# EAGLE schematic Control.Board (EAGLE 6.6.0)

## Sheet 1 of 5: Интеграция с датчиками
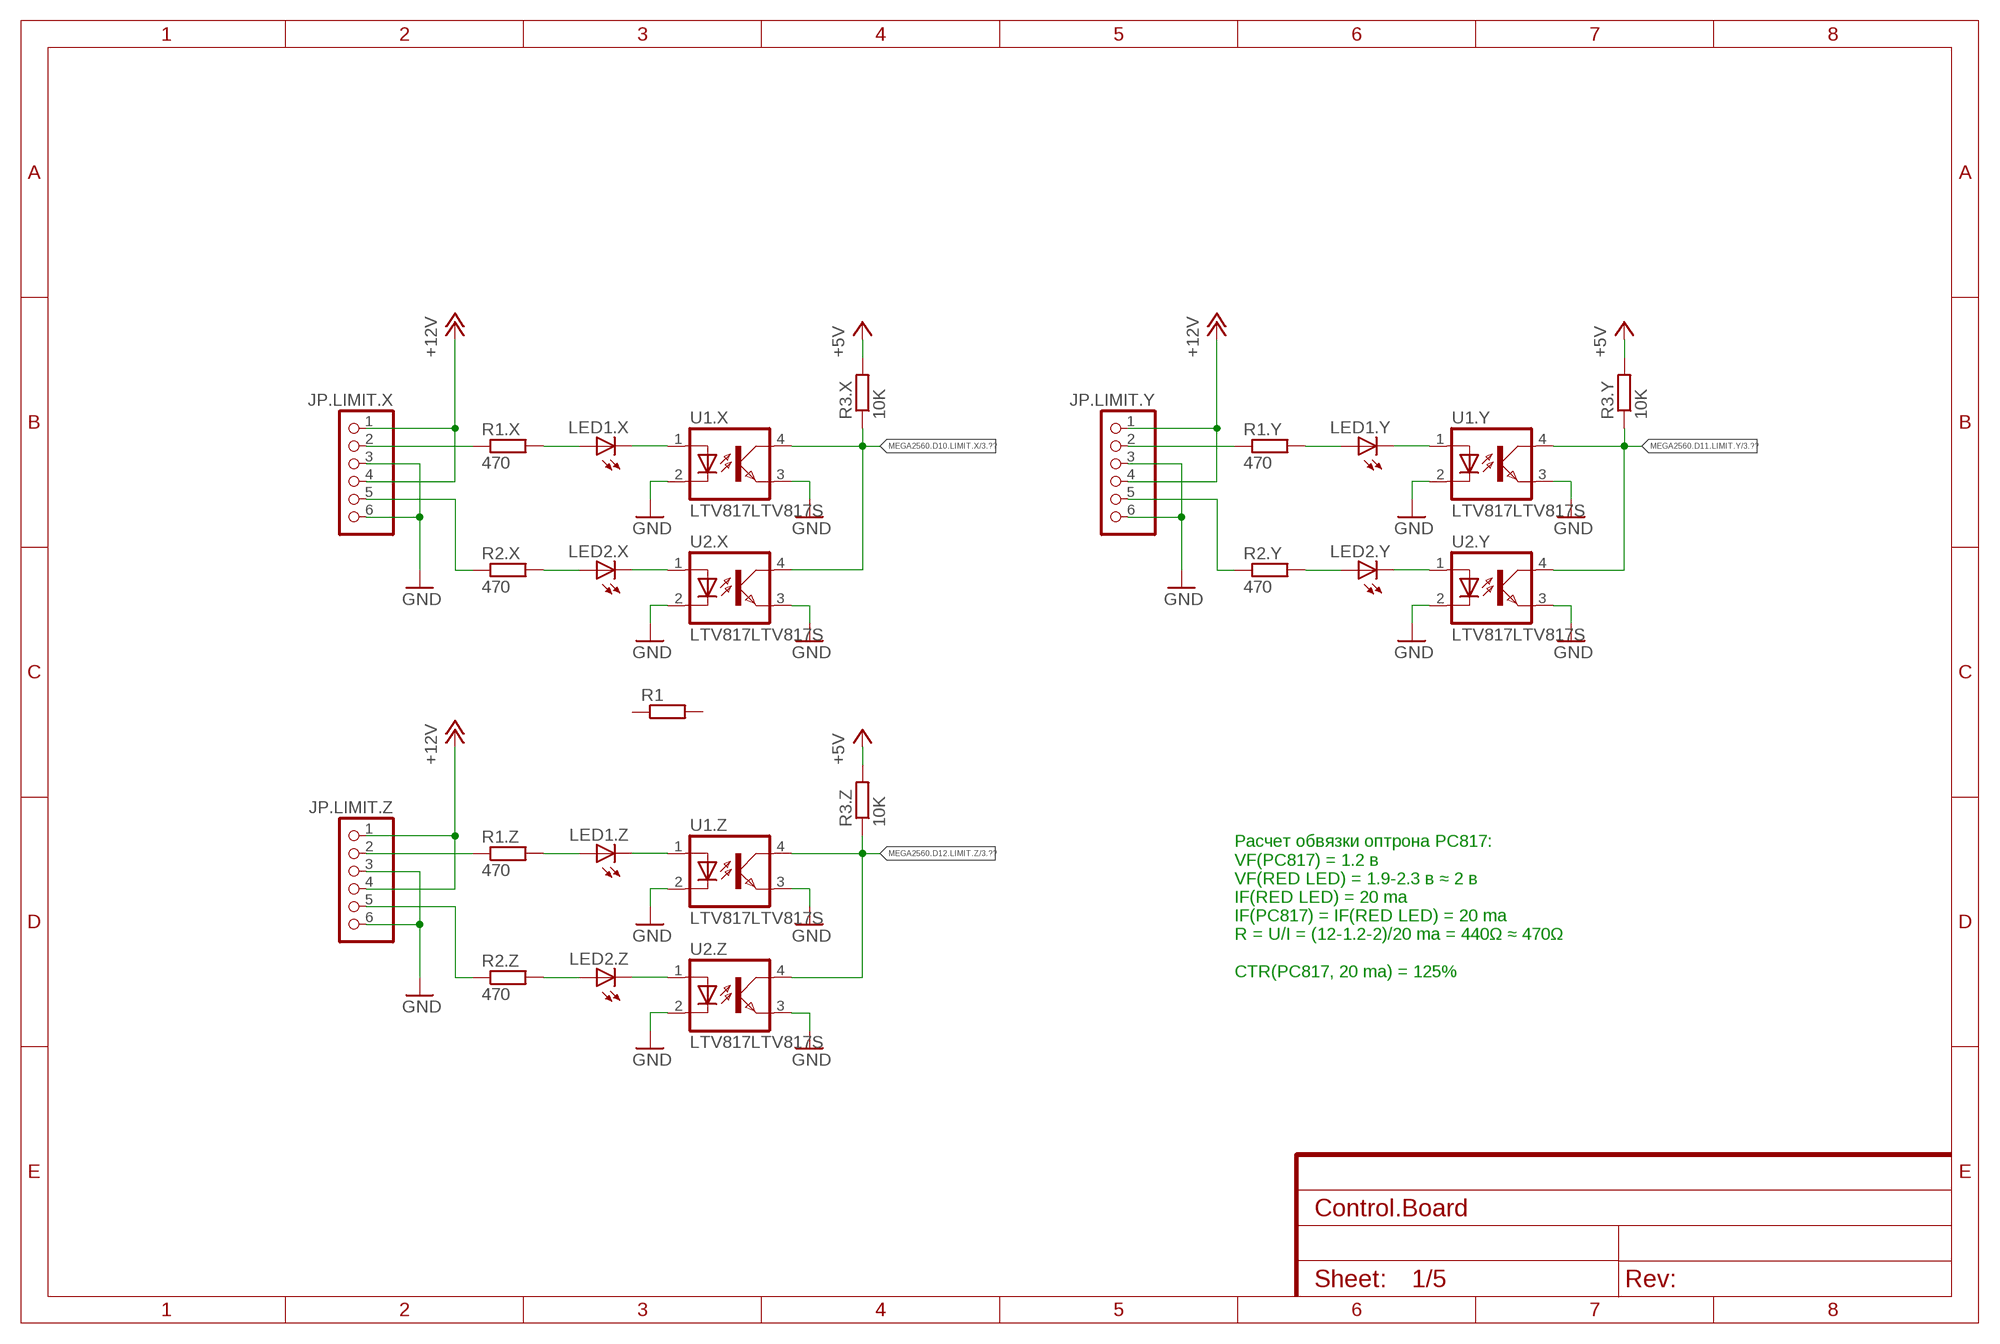
[diagram p0: schematic, sheet 1]

### Parts
JP.LIMIT.X  PINHD-1X6  [1X06]
JP.LIMIT.Y  PINHD-1X6  [1X06]
JP.LIMIT.Z  PINHD-1X6  [1X06]
LED1.X  LEDCHIPLED_0805  [CHIPLED_0805]
LED1.Y  LEDCHIPLED_0805  [CHIPLED_0805]
LED1.Z  LEDCHIPLED_0805  [CHIPLED_0805]
LED2.X  LEDCHIPLED_0805  [CHIPLED_0805]
LED2.Y  LEDCHIPLED_0805  [CHIPLED_0805]
LED2.Z  LEDCHIPLED_0805  [CHIPLED_0805]
R1  R-EU_M1206  [M1206]
R1.X  470  R-EU_M0805  [M0805]
R1.Y  470  R-EU_M0805  [M0805]
R1.Z  470  R-EU_M0805  [M0805]
R2.X  470  R-EU_M0805  [M0805]
R2.Y  470  R-EU_M0805  [M0805]
R2.Z  470  R-EU_M0805  [M0805]
R3.X  10K  R-EU_M0805  [M0805]
R3.Y  10K  R-EU_M0805  [M0805]
R3.Z  10K  R-EU_M0805  [M0805]
U1.X  LTV817LTV817S  [DIL4-SMD]
U1.Y  LTV817LTV817S  [DIL4-SMD]
U1.Z  LTV817LTV817S  [DIL4-SMD]
U2.X  LTV817LTV817S  [DIL4-SMD]
U2.Y  LTV817LTV817S  [DIL4-SMD]
U2.Z  LTV817LTV817S  [DIL4-SMD]

### Nets
+5V: R3.X.2 R3.Y.2 R3.Z.2 ; also sheet 4,5
+12V: JP.LIMIT.X.1 JP.LIMIT.X.4 JP.LIMIT.Y.1 JP.LIMIT.Y.4 JP.LIMIT.Z.1 JP.LIMIT.Z.4
GND: JP.LIMIT.X.3 JP.LIMIT.X.6 JP.LIMIT.Y.3 JP.LIMIT.Y.6 JP.LIMIT.Z.3 JP.LIMIT.Z.6 U1.X.2(C) U1.X.3(EMIT) U1.Y.2(C) U1.Y.3(EMIT) U1.Z.2(C) U1.Z.3(EMIT) U2.X.2(C) U2.X.3(EMIT) U2.Y.2(C) U2.Y.3(EMIT) U2.Z.2(C) U2.Z.3(EMIT) ; also sheet 5
MEGA2560.D10.LIMIT.X: R3.X.1 U1.X.4(COL) U2.X.4(COL) ; also sheet 3
MEGA2560.D11.LIMIT.Y: R3.Y.1 U1.Y.4(COL) U2.Y.4(COL) ; also sheet 3
MEGA2560.D12.LIMIT.Z: R3.Z.1 U1.Z.4(COL) U2.Z.4(COL) ; also sheet 3
N$1: LED2.X.C U2.X.1(A)
N$2: JP.LIMIT.Y.2 R1.Y.1
N$3: LED1.Y.A R1.Y.2
N$4: JP.LIMIT.X.2 R1.X.1
N$5: LED1.X.A R1.X.2
N$6: JP.LIMIT.X.5 R2.X.1
N$7: LED2.X.A R2.X.2
N$8: LED1.X.C U1.X.1(A)
N$9: JP.LIMIT.Y.5 R2.Y.1
N$10: LED2.Y.A R2.Y.2
N$11: LED2.Y.C U2.Y.1(A)
N$12: LED1.Y.C U1.Y.1(A)
N$13: JP.LIMIT.Z.2 R1.Z.1
N$14: LED1.Z.A R1.Z.2
N$15: JP.LIMIT.Z.5 R2.Z.1
N$16: LED2.Z.A R2.Z.2
N$17: LED2.Z.C U2.Z.1(A)
N$18: LED1.Z.C U1.Z.1(A)
Unconnected: R1.1 R1.2

### Notes on the sheet
- Расчет обвязки оптрона PC817:
  VF(PC817) = 1.2 в
  VF(RED LED) = 1.9-2.3 в ≈ 2 в
  IF(RED LED) = 20 ma
  IF(PC817) = IF(RED LED) = 20 ma
  R = U/I = (12-1.2-2)/20 ma = 440Ω ≈ 470Ω
  
  CTR(PC817, 20 ma) = 125%

## Sheet 2 of 5: Измерение частоты

## Sheet 3 of 5: Arduino Mega2560 Shield
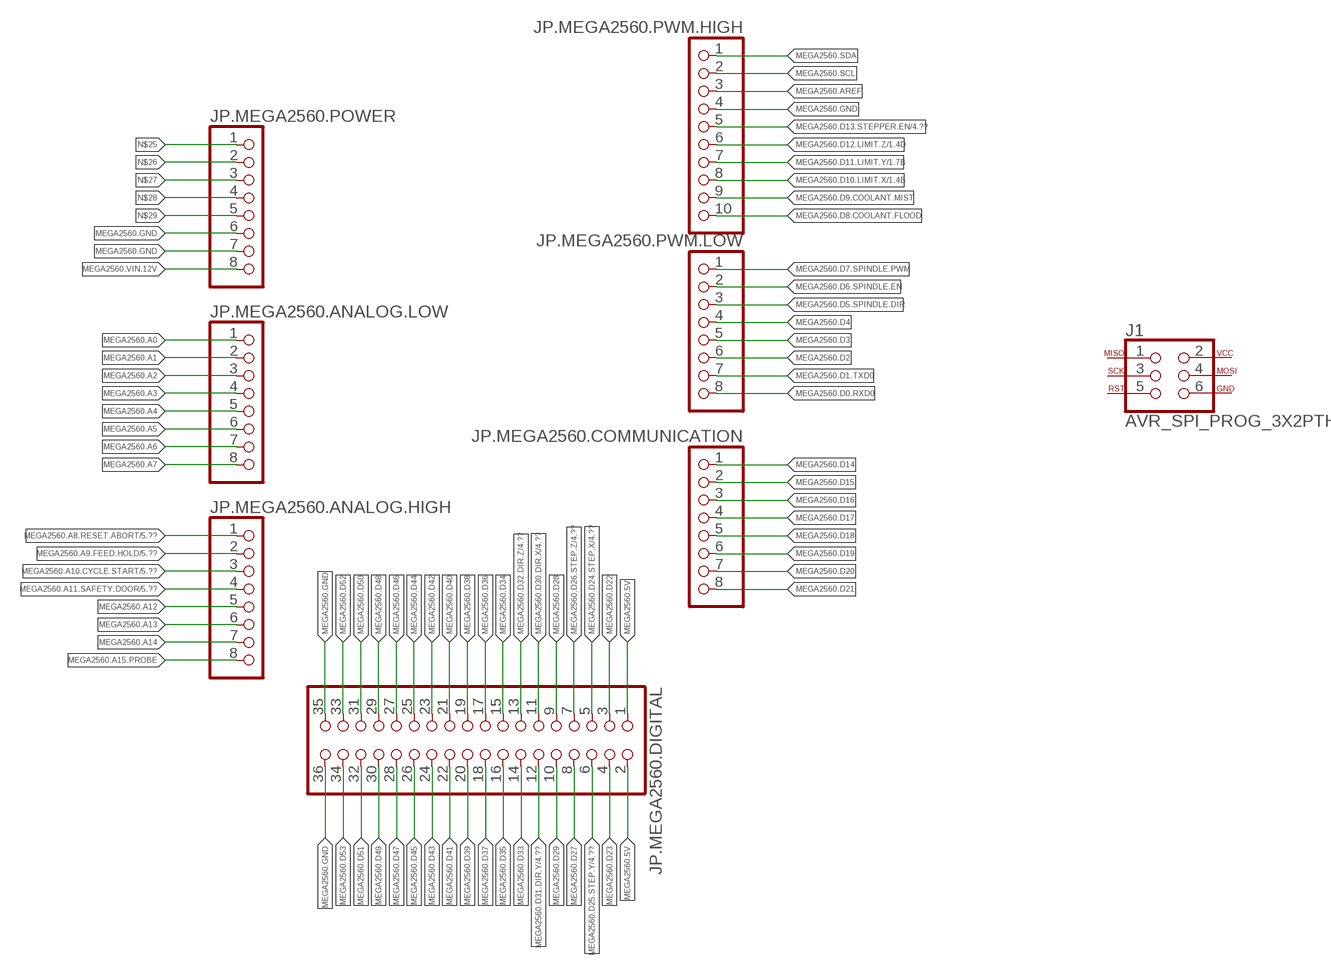
[diagram p1: schematic, sheet 3]

### Parts
J1  AVR_SPI_PROG_3X2PTH  [2X3]
JP.MEGA2560.ANALOG.HIGH  PINHD-1X8  [1X08]
JP.MEGA2560.ANALOG.LOW  PINHD-1X8  [1X08]
JP.MEGA2560.COMMUNICATION  PINHD-1X8  [1X08]
JP.MEGA2560.DIGITAL  PINHD-2X18  [2X18]
JP.MEGA2560.POWER  PINHD-1X8  [1X08]
JP.MEGA2560.PWM.HIGH  PINHD-1X10  [1X10]
JP.MEGA2560.PWM.LOW  PINHD-1X8  [1X08]

### Nets
MEGA2560.5V: JP.MEGA2560.DIGITAL.1 JP.MEGA2560.DIGITAL.2
MEGA2560.A0: JP.MEGA2560.ANALOG.LOW.1
MEGA2560.A1: JP.MEGA2560.ANALOG.LOW.2
MEGA2560.A2: JP.MEGA2560.ANALOG.LOW.3
MEGA2560.A3: JP.MEGA2560.ANALOG.LOW.4
MEGA2560.A4: JP.MEGA2560.ANALOG.LOW.5
MEGA2560.A5: JP.MEGA2560.ANALOG.LOW.6
MEGA2560.A6: JP.MEGA2560.ANALOG.LOW.7
MEGA2560.A7: JP.MEGA2560.ANALOG.LOW.8
MEGA2560.A8.RESET.ABORT: JP.MEGA2560.ANALOG.HIGH.1 ; also sheet 5
MEGA2560.A9.FEED.HOLD: JP.MEGA2560.ANALOG.HIGH.2 ; also sheet 5
MEGA2560.A10.CYCLE.START: JP.MEGA2560.ANALOG.HIGH.3 ; also sheet 5
MEGA2560.A11.SAFETY.DOOR: JP.MEGA2560.ANALOG.HIGH.4 ; also sheet 5
MEGA2560.A12: JP.MEGA2560.ANALOG.HIGH.5
MEGA2560.A13: JP.MEGA2560.ANALOG.HIGH.6
MEGA2560.A14: JP.MEGA2560.ANALOG.HIGH.7
MEGA2560.A15.PROBE: JP.MEGA2560.ANALOG.HIGH.8
MEGA2560.AREF: JP.MEGA2560.PWM.HIGH.3
MEGA2560.D0.RXD0: JP.MEGA2560.PWM.LOW.8
MEGA2560.D1.TXD0: JP.MEGA2560.PWM.LOW.7
MEGA2560.D2: JP.MEGA2560.PWM.LOW.6
MEGA2560.D3: JP.MEGA2560.PWM.LOW.5
MEGA2560.D4: JP.MEGA2560.PWM.LOW.4
MEGA2560.D5.SPINDLE.DIR: JP.MEGA2560.PWM.LOW.3
MEGA2560.D6.SPINDLE.EN: JP.MEGA2560.PWM.LOW.2
MEGA2560.D7.SPINDLE.PWM: JP.MEGA2560.PWM.LOW.1
MEGA2560.D8.COOLANT.FLOOD: JP.MEGA2560.PWM.HIGH.10
MEGA2560.D9.COOLANT.MIST: JP.MEGA2560.PWM.HIGH.9
MEGA2560.D10.LIMIT.X: JP.MEGA2560.PWM.HIGH.8 ; also sheet 1
MEGA2560.D11.LIMIT.Y: JP.MEGA2560.PWM.HIGH.7 ; also sheet 1
MEGA2560.D12.LIMIT.Z: JP.MEGA2560.PWM.HIGH.6 ; also sheet 1
MEGA2560.D13.STEPPER.EN: JP.MEGA2560.PWM.HIGH.5 ; also sheet 4
MEGA2560.D14: JP.MEGA2560.COMMUNICATION.1
MEGA2560.D15: JP.MEGA2560.COMMUNICATION.2
MEGA2560.D16: JP.MEGA2560.COMMUNICATION.3
MEGA2560.D17: JP.MEGA2560.COMMUNICATION.4
MEGA2560.D18: JP.MEGA2560.COMMUNICATION.5
MEGA2560.D19: JP.MEGA2560.COMMUNICATION.6
MEGA2560.D20: JP.MEGA2560.COMMUNICATION.7
MEGA2560.D21: JP.MEGA2560.COMMUNICATION.8
MEGA2560.D22: JP.MEGA2560.DIGITAL.3
MEGA2560.D23: JP.MEGA2560.DIGITAL.4
MEGA2560.D24.STEP.X: JP.MEGA2560.DIGITAL.5 ; also sheet 4
MEGA2560.D25.STEP.Y: JP.MEGA2560.DIGITAL.6 ; also sheet 4
MEGA2560.D26.STEP.Z: JP.MEGA2560.DIGITAL.7 ; also sheet 4
MEGA2560.D27: JP.MEGA2560.DIGITAL.8
MEGA2560.D28: JP.MEGA2560.DIGITAL.9
MEGA2560.D29: JP.MEGA2560.DIGITAL.10
MEGA2560.D30.DIR.X: JP.MEGA2560.DIGITAL.11 ; also sheet 4
MEGA2560.D31.DIR.Y: JP.MEGA2560.DIGITAL.12 ; also sheet 4
MEGA2560.D32.DIR.Z: JP.MEGA2560.DIGITAL.13 ; also sheet 4
MEGA2560.D33: JP.MEGA2560.DIGITAL.14
MEGA2560.D34: JP.MEGA2560.DIGITAL.15
MEGA2560.D35: JP.MEGA2560.DIGITAL.16
MEGA2560.D36: JP.MEGA2560.DIGITAL.17
MEGA2560.D37: JP.MEGA2560.DIGITAL.18
MEGA2560.D38: JP.MEGA2560.DIGITAL.19
MEGA2560.D39: JP.MEGA2560.DIGITAL.20
MEGA2560.D40: JP.MEGA2560.DIGITAL.21
MEGA2560.D41: JP.MEGA2560.DIGITAL.22
MEGA2560.D42: JP.MEGA2560.DIGITAL.23
MEGA2560.D43: JP.MEGA2560.DIGITAL.24
MEGA2560.D44: JP.MEGA2560.DIGITAL.25
MEGA2560.D45: JP.MEGA2560.DIGITAL.26
MEGA2560.D46: JP.MEGA2560.DIGITAL.27
MEGA2560.D47: JP.MEGA2560.DIGITAL.28
MEGA2560.D48: JP.MEGA2560.DIGITAL.29
MEGA2560.D49: JP.MEGA2560.DIGITAL.30
MEGA2560.D50: JP.MEGA2560.DIGITAL.31
MEGA2560.D51: JP.MEGA2560.DIGITAL.32
MEGA2560.D52: JP.MEGA2560.DIGITAL.33
MEGA2560.D53: JP.MEGA2560.DIGITAL.34
MEGA2560.GND: JP.MEGA2560.DIGITAL.35 JP.MEGA2560.DIGITAL.36 JP.MEGA2560.POWER.6 JP.MEGA2560.POWER.7 JP.MEGA2560.PWM.HIGH.4
MEGA2560.SCL: JP.MEGA2560.PWM.HIGH.2
MEGA2560.SDA: JP.MEGA2560.PWM.HIGH.1
MEGA2560.VIN.12V: JP.MEGA2560.POWER.8
N$25: JP.MEGA2560.POWER.1
N$26: JP.MEGA2560.POWER.2
N$27: JP.MEGA2560.POWER.3
N$28: JP.MEGA2560.POWER.4
N$29: JP.MEGA2560.POWER.5
Unconnected: J1.1 J1.2 J1.3 J1.4 J1.5 J1.6

## Sheet 4 of 5: Connectors
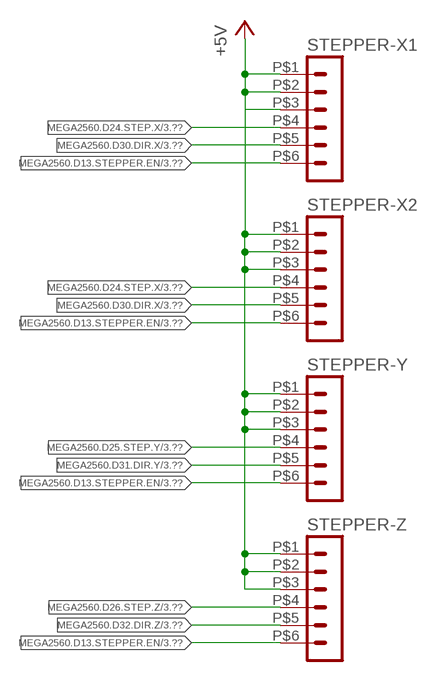
[diagram p2: schematic, sheet 4]

### Parts
STEPPER-X1  HEADER_POS6_43045-0600  [43045-0600]
STEPPER-X2  HEADER_POS6_43045-0600  [43045-0600]
STEPPER-Y  HEADER_POS6_43045-0600  [43045-0600]
STEPPER-Z  HEADER_POS6_43045-0600  [43045-0600]

### Nets
+5V: STEPPER-X1.P$1 STEPPER-X1.P$2 STEPPER-X1.P$3 STEPPER-X2.P$1 STEPPER-X2.P$2 STEPPER-X2.P$3 STEPPER-Y.P$1 STEPPER-Y.P$2 STEPPER-Y.P$3 STEPPER-Z.P$1 STEPPER-Z.P$2 STEPPER-Z.P$3 ; also sheet 1,5
MEGA2560.D13.STEPPER.EN: STEPPER-X1.P$6 STEPPER-X2.P$6 STEPPER-Y.P$6 STEPPER-Z.P$6 ; also sheet 3
MEGA2560.D24.STEP.X: STEPPER-X1.P$4 STEPPER-X2.P$4 ; also sheet 3
MEGA2560.D25.STEP.Y: STEPPER-Y.P$4 ; also sheet 3
MEGA2560.D26.STEP.Z: STEPPER-Z.P$4 ; also sheet 3
MEGA2560.D30.DIR.X: STEPPER-X1.P$5 STEPPER-X2.P$5 ; also sheet 3
MEGA2560.D31.DIR.Y: STEPPER-Y.P$5 ; also sheet 3
MEGA2560.D32.DIR.Z: STEPPER-Z.P$5 ; also sheet 3

## Sheet 5 of 5: Buttons
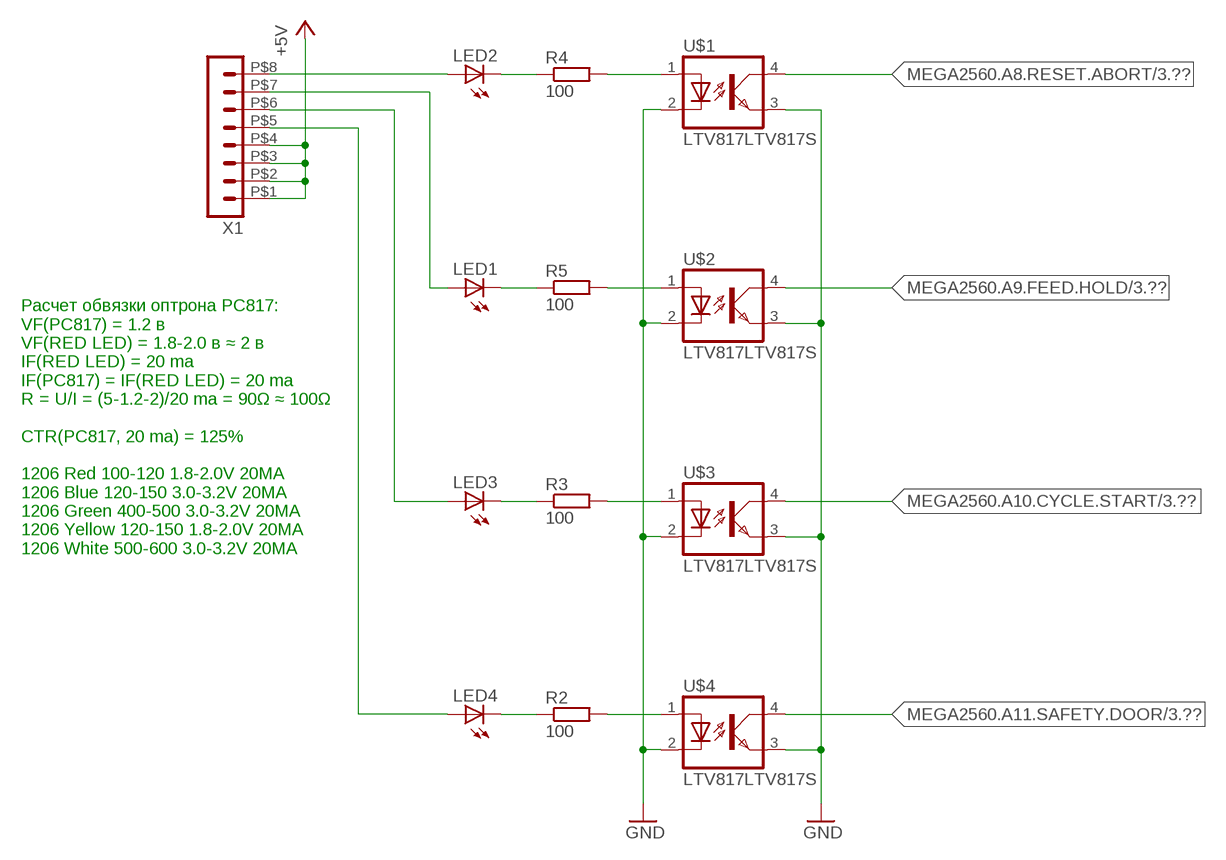
[diagram p3: schematic, sheet 5]

### Parts
LED1  LEDCHIPLED_1206  [CHIPLED_1206]
LED2  LEDCHIPLED_1206  [CHIPLED_1206]
LED3  LEDCHIPLED_1206  [CHIPLED_1206]
LED4  LEDCHIPLED_1206  [CHIPLED_1206]
R2  100  R-EU_M1206  [M1206]
R3  100  R-EU_M1206  [M1206]
R4  100  R-EU_M1206  [M1206]
R5  100  R-EU_M1206  [M1206]
U$1  LTV817LTV817S  [DIL4-SMD]
U$2  LTV817LTV817S  [DIL4-SMD]
U$3  LTV817LTV817S  [DIL4-SMD]
U$4  LTV817LTV817S  [DIL4-SMD]
X1  HEADER_POS8_43045-0800  [43045-0800]

### Nets
+5V: X1.P$1 X1.P$2 X1.P$3 X1.P$4 ; also sheet 1,4
GND: U$1.2(C) U$1.3(EMIT) U$2.2(C) U$2.3(EMIT) U$3.2(C) U$3.3(EMIT) U$4.2(C) U$4.3(EMIT) ; also sheet 1
MEGA2560.A8.RESET.ABORT: U$1.4(COL) ; also sheet 3
MEGA2560.A9.FEED.HOLD: U$2.4(COL) ; also sheet 3
MEGA2560.A10.CYCLE.START: U$3.4(COL) ; also sheet 3
MEGA2560.A11.SAFETY.DOOR: U$4.4(COL) ; also sheet 3
N$19: LED2.A X1.P$8
N$20: LED1.A X1.P$7
N$21: LED3.A X1.P$6
N$22: LED2.C R4.1
N$23: R4.2 U$1.1(A)
N$24: R5.2 U$2.1(A)
N$30: LED1.C R5.1
N$31: LED4.A X1.P$5
N$32: LED3.C R3.1
N$33: LED4.C R2.1
N$34: R2.2 U$4.1(A)
N$35: R3.2 U$3.1(A)

### Notes on the sheet
- Расчет обвязки оптрона PC817:
  VF(PC817) = 1.2 в
  VF(RED LED) = 1.8-2.0 в ≈ 2 в
  IF(RED LED) = 20 ma
  IF(PC817) = IF(RED LED) = 20 ma
  R = U/I = (5-1.2-2)/20 ma = 90Ω ≈ 100Ω
  
  CTR(PC817, 20 ma) = 125%
  
  1206 Red 100-120 1.8-2.0V 20MA
  1206 Blue 120-150 3.0-3.2V 20MA
  1206 Green 400-500 3.0-3.2V 20MA
  1206 Yellow 120-150 1.8-2.0V 20MA
  1206 White 500-600 3.0-3.2V 20MA

## Library data of the parts
J1 = SparkFun-Connectors:AVR_SPI_PROG_3X2: AVR ISP 6 Pin This is the reduced ISP connector for AVR programming. Common on Arduino. This footprint will take up less PCB space and can be used with a 10-pin to 6-pin adapter such as SKU: BOB-08508 **Special note about "TEST_POINT" package. The stop mask is on the top side, so if you want your programming test points to be on the bottom of your board, make sure to place this package on the bottom side of the board. This also ensure that the orientation to program from the bottom side will be correct. SparkFun Products: SparkFun ISP Pogo Adapter <https://www.sparkfun.com/products/11591> - NS Tiny AVR Programmer <https://www.sparkfun.com/products/11801> -PTH
JP.LIMIT.X JP.LIMIT.Y JP.LIMIT.Z = pinhead:PINHD-1X6: PIN HEADER
JP.MEGA2560.ANALOG.HIGH JP.MEGA2560.ANALOG.LOW JP.MEGA2560.COMMUNICATION JP.MEGA2560.POWER JP.MEGA2560.PWM.LOW = pinhead:PINHD-1X8: PIN HEADER
JP.MEGA2560.DIGITAL = pinhead:PINHD-2X18: PIN HEADER
JP.MEGA2560.PWM.HIGH = pinhead:PINHD-1X10: PIN HEADER
LED1 LED1.X LED1.Y LED1.Z LED2 LED2.X LED2.Y LED2.Z LED3 LED4 = led:LED: LED OSRAM: - CHIPLED LG R971, LG N971, LY N971, LG Q971, LY Q971, LO R971, LY R971 LH N974, LH R974 LS Q976, LO Q976, LY Q976 LO Q996 - Hyper CHIPLED LW Q18S LB Q993, LB Q99A, LB R99A - SideLED LS A670, LO A670, LY A670, LG A670, LP A670 LB A673, LV A673, LT A673, LW A673 LH A674 LY A675 LS A676, LA A676, LO A676, LY A676, LW A676 LS A679, LY A679, LG A679 - Hyper Micro SIDELED® LS Y876, LA Y876, LO Y876, LY Y876 LT Y87S - SmartLED LW L88C, LW L88S LB L89C, LB L89S, LG L890 LS L89K, LO L89K, LY L89K LS L896, LA L896, LO L896, LY L896 - TOPLED LS T670, LO T670, LY T670, LG T670, LP T670 LSG T670, LSP T670, LSY T670, LOP T670, LYG T670 LG T671, LOG T671, LSG T671 LB T673, LV T673, LT T673, LW T673 LH T674 LS T676, LA T676, LO T676, LY T676, LB T676, LH T676, LSB T676, LW T676 LB T67C, LV T67C, LT T67C, LS T67K, LO T67K, LY T67K, LW E67C LS E67B, LA E67B, LO E67B, LY E67B, LB E67C, LV E67C, LT E67C LW T67C LS T679, LY T679, LG T679 LS T770, LO T770, LY T770, LG T770, LP T770 LB T773, LV T773, LT T773, LW T773 LH T774 LS E675, LA E675, LY E675, LS T675 LS T776, LA T776, LO T776, LY T776, LB T776 LHGB T686 LT T68C, LB T68C - Hyper Mini TOPLED® LB M676 - Mini TOPLED Santana® LG M470 LS M47K, LO M47K, LY M47K Source: http://www.osram.convergy.de LUXEON: - LUMILED® LXK2-PW12-R00, LXK2-PW12-S00, LXK2-PW14-U00, LXK2-PW14-V00 LXK2-PM12-R00, LXK2-PM12-S00, LXK2-PM14-U00 LXK2-PE12-Q00, LXK2-PE12-R00, LXK2-PE12-S00, LXK2-PE14-T00, LXK2-PE14-U00 LXK2-PB12-K00, LXK2-PB12-L00, LXK2-PB12-M00, LXK2-PB14-N00, LXK2-PB14-P00, LXK2-PB14-Q00 LXK2-PR12-L00, LXK2-PR12-M00, LXK2-PR14-Q00, LXK2-PR14-R00 LXK2-PD12-Q00, LXK2-PD12-R00, LXK2-PD12-S00 LXK2-PH12-R00, LXK2-PH12-S00 LXK2-PL12-P00, LXK2-PL12-Q00, LXK2-PL12-R00 Source: www.luxeon.com KINGBRIGHT: KA-3528ASYC Source: www.kingbright.com
R1 R1.X R1.Y R1.Z R2 R2.X R2.Y R2.Z R3 R3.X R3.Y R3.Z R4 R5 = rcl:R-EU_: RESISTOR, European symbol
STEPPER-X1 STEPPER-X2 STEPPER-Y STEPPER-Z = con-molex-micro-fit-3_0:HEADER_POS6_?: Molex - Micro-Fit 3.0 Series connector, 3.00mm (0.118") pitch header, 6 positions.
U1.X U1.Y U1.Z U2.X U2.Y U2.Z U$1-U$4 = net173:LTV817
X1 = con-molex-micro-fit-3_0:HEADER_POS8_?: Molex - Micro-Fit 3.0 Series connector, 3.00mm (0.118") pitch header, 8 positions.